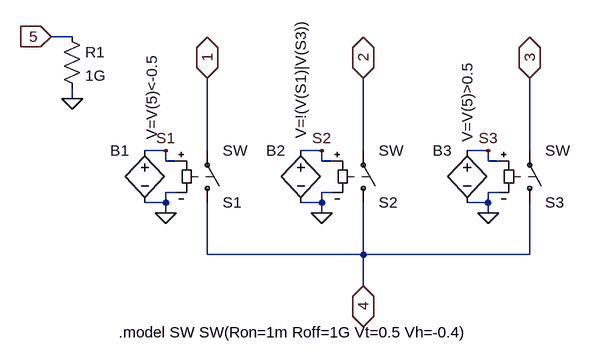
[diagram p0: schematic spttg.asc]
spttg.asc, the LTspice schematic file:
Version 4
SHEET 1 880 680
WIRE -160 -144 -192 -144
WIRE -160 -48 -160 -64
WIRE -16 32 -48 32
WIRE 48 32 48 -80
WIRE 224 32 192 32
WIRE 288 32 288 -80
WIRE 480 32 448 32
WIRE 544 32 544 -80
WIRE -16 48 -16 32
WIRE 0 48 -16 48
WIRE 224 48 224 32
WIRE 240 48 224 48
WIRE 480 48 480 32
WIRE 496 48 480 48
WIRE 0 96 -16 96
WIRE 240 96 224 96
WIRE 496 96 480 96
WIRE -16 112 -16 96
WIRE -16 112 -48 112
WIRE 224 112 224 96
WIRE 224 112 192 112
WIRE 480 112 480 96
WIRE 480 112 448 112
WIRE -16 128 -16 112
WIRE 224 128 224 112
WIRE 480 128 480 112
WIRE 48 192 48 112
WIRE 288 192 288 112
WIRE 288 192 48 192
WIRE 544 192 544 112
WIRE 544 192 288 192
WIRE 288 240 288 192
FLAG 48 -80 1
IOPIN 48 -80 BiDir
FLAG 288 -80 2
IOPIN 288 -80 BiDir
FLAG 288 240 4
IOPIN 288 240 BiDir
FLAG -192 -144 5
IOPIN -192 -144 In
FLAG -16 128 0
FLAG 544 -80 3
IOPIN 544 -80 BiDir
FLAG 224 128 0
FLAG 480 128 0
FLAG -160 -48 0
FLAG -16 32 S1
FLAG 224 32 S2
FLAG 480 32 S3
SYMBOL sw 48 128 M180
SYMATTR InstName S1
SYMBOL sw 288 128 M180
SYMATTR InstName S2
SYMBOL sw 544 128 M180
SYMATTR InstName S3
SYMBOL bv -48 16 M0
WINDOW 3 -11 -1 VLeft 2
SYMATTR Value V=V(5)<-0.5
SYMATTR InstName B1
SYMBOL bv 192 16 M0
WINDOW 3 0 -2 VLeft 2
SYMATTR Value V=!(V(S1)|V(S3))
SYMATTR InstName B2
SYMBOL bv 448 16 M0
WINDOW 3 0 3 VLeft 2
SYMATTR Value V=V(5)>0.5
SYMATTR InstName B3
SYMBOL res -176 -160 R0
SYMATTR InstName R1
SYMATTR Value 1G
TEXT -88 312 Left 2 !.model SW SW(Ron=1m Roff=1G Vt=0.5 Vh=-0.4)

The netlist it stands for:
* spttg.asc
S1 4 1 S1 0 SW
S2 4 2 S2 0 SW
S3 4 3 S3 0 SW
B1 S1 0 V=V(5)<-0.5
B2 S2 0 V=!(V(S1)|V(S3))
B3 S3 0 V=V(5)>0.5
R1 5 0 1G
.model SW SW(Ron=1m Roff=1G Vt=0.5 Vh=-0.4)
.backanno
.end